# EAGLE design MIDIpod (EAGLE 9.6.2)
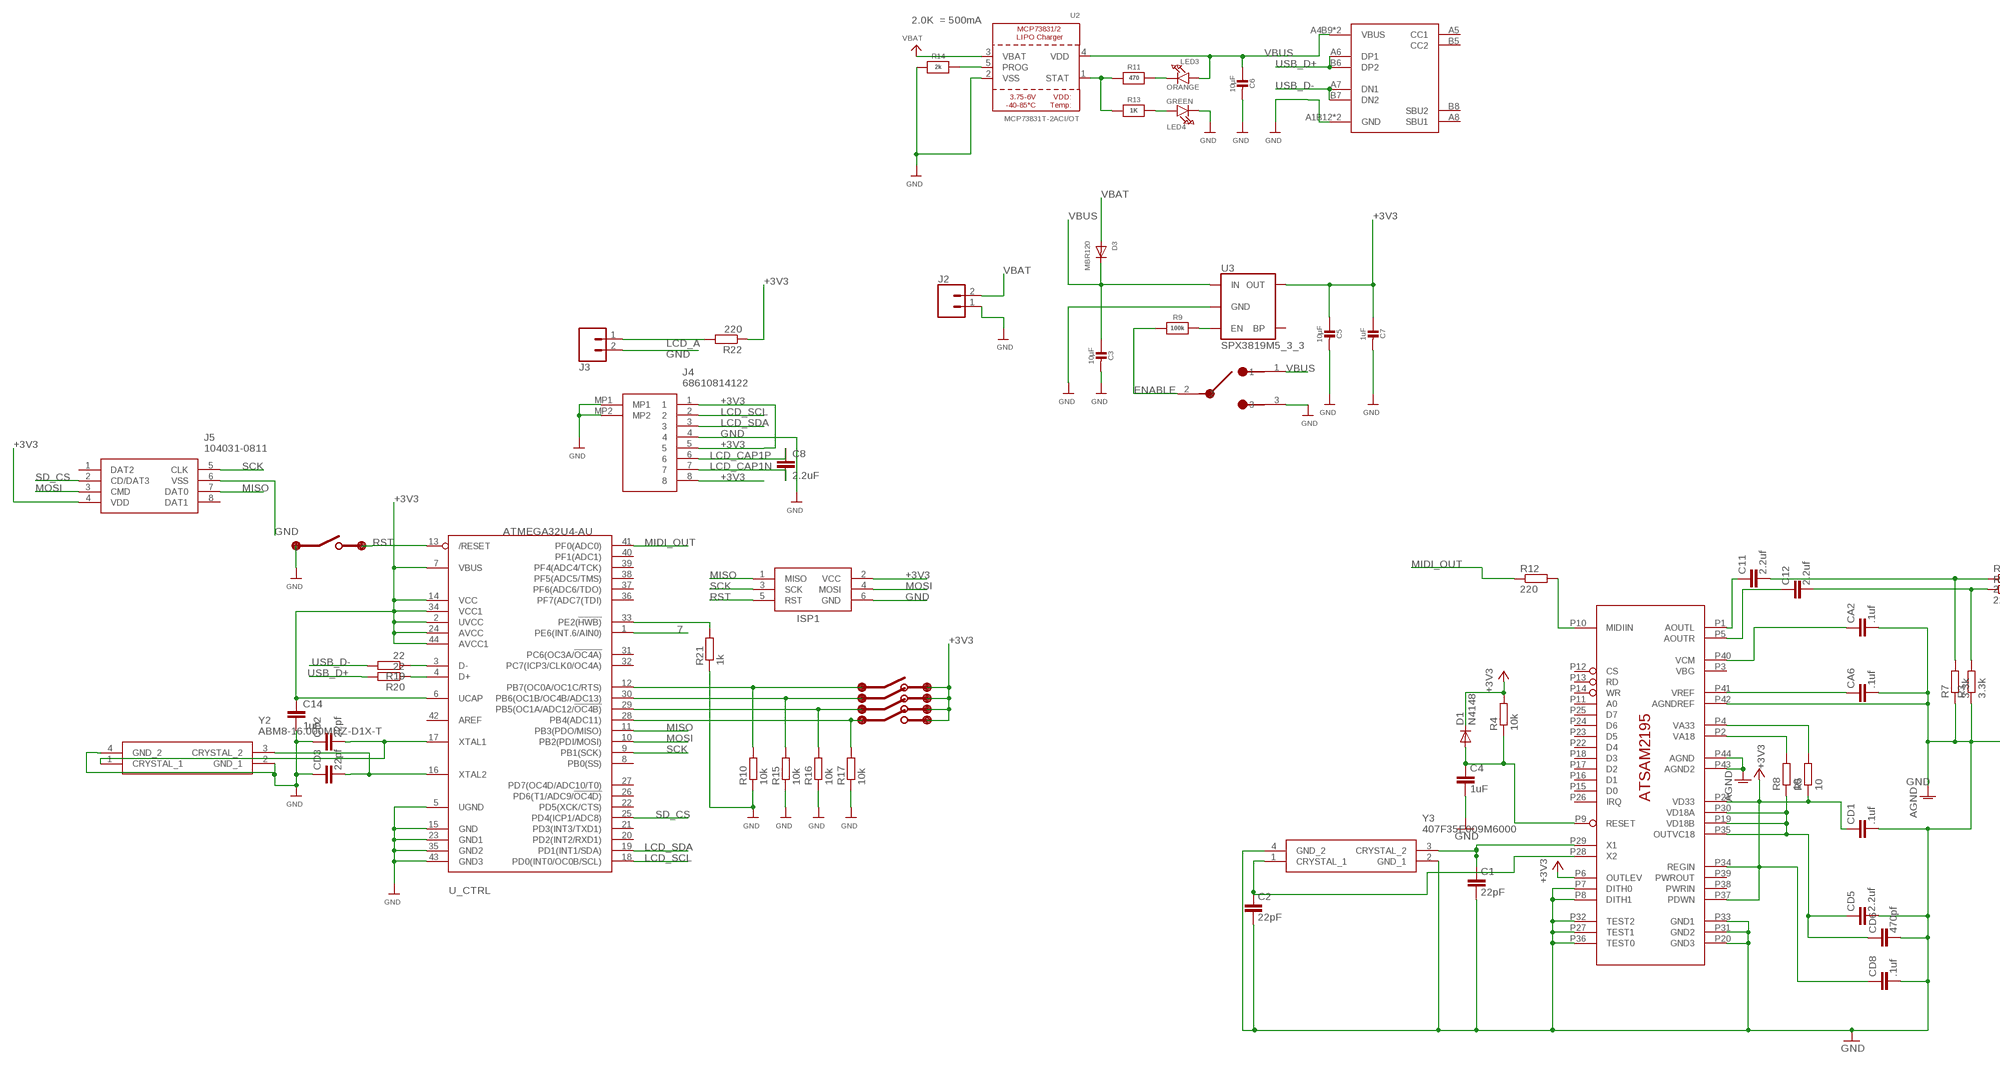
[diagram p0: schematic, sheet 1, part 1 of 2]
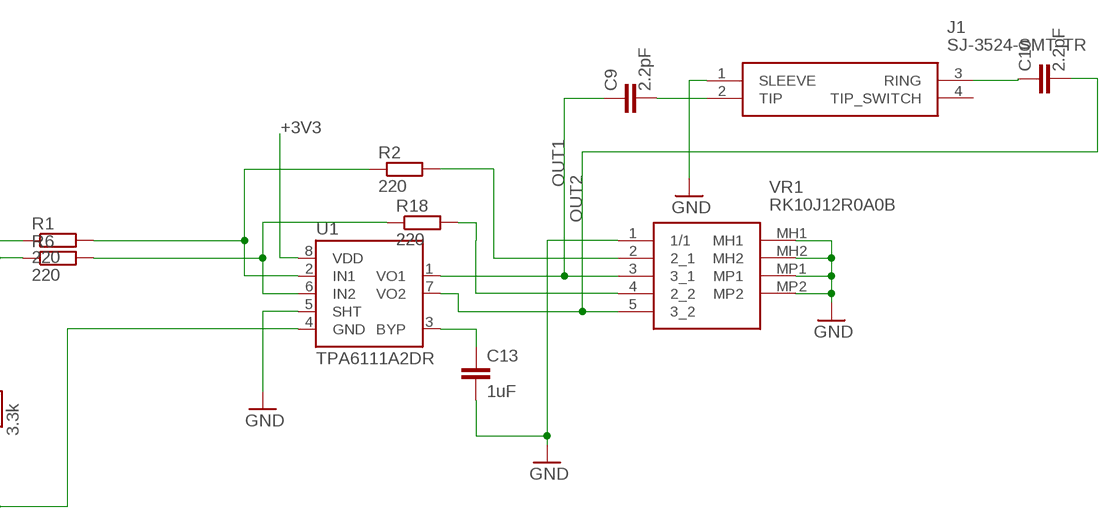
[diagram p1: schematic, sheet 1, part 2 of 2]

## Parts
BUTTON1  1U_PAD  [SILICONE_SWITCH]
BUTTON2  1U_PAD  [SILICONE_SWITCH]
BUTTON3  1U_PAD  [SILICONE_SWITCH]
BUTTON4  1U_PAD  [SILICONE_SWITCH]
BUTTON5  1U_PAD  [SILICONE_SWITCH]
C1  22pF  C-EUC0603  [C0603]
C2  22pF  C-EUC0603  [C0603]
C3  10µF  CAP_CERAMIC0805-NOOUTLINE  [0805-NO]
C4  1uF  C-EUC0603  [C0603]
C5  10µF  CAP_CERAMIC0805-NOOUTLINE  [0805-NO]
C6  10µF  CAP_CERAMIC0805-NOOUTLINE  [0805-NO]
C7  1uF  CAP_CERAMIC0805-NOOUTLINE  [0805-NO]
C8  2.2uF  2.2UF-0805-25V-(+80/-20%)  [0805]
C9  2.2pF  C-EUC0603  [C0603]
C10  2.2pF  C-EUC0603  [C0603]
C11  2.2uf  C-EUC0603  [C0603]
C12  2.2uf  C-EUC0603  [C0603]
C13  1uF  0.1UF-0402-16V-10%  [0402]
C14  1uF  0.1UF-0402-16V-10%  [0402]
CA2  .1uf  C-EUC0603  [C0603]
CA6  .1uf  C-EUC0603  [C0603]
CD1  .1uf  C-EUC0603  [C0603]
CD2  22pf  C-EUC0603  [C0603]
CD3  22pf  C-EUC0603  [C0603]
CD5  2.2uf  C-EUC0603  [C0603]
CD6  470pf  C-EUC0603  [C0603]
CD8  .1uf  C-EUC0603  [C0603]
D1  N4148  DIODESOD-123  [SOD-123]
D3  MBR120  DIODESOD-123  [SOD-123]
ISP1  AVRISP-6  [AVRISP]
J1  SJ-3524-SMT-TR  [SJ-3524-SMT-TR]
J2  CONN_02  [1X02]
J3  CONN_02  [1X02]
J4  68610814122  [68610814122]
J5  104031-0811  [1040310811]
LED3  ORANGE  LED0805_NOOUTLINE  [CHIPLED_0805_NOOUTLINE]
LED4  GREEN  LED0805_NOOUTLINE  [CHIPLED_0805_NOOUTLINE]
POWER_SW  ALPSSLIDESW  [SWITCH-SSSS810701]
R1  220  R-EU_R0603  [R0603]
R2  220  R-EU_R0603  [R0603]
R3  3.3k  R-EU_R0603  [R0603]
R4  10k  R-EU_R0603  [R0603]
R5  10  R-EU_R0603  [R0603]
R6  220  R-EU_R0603  [R0603]
R7  3.3k  R-EU_R0603  [R0603]
R8  10  R-EU_R0603  [R0603]
R9  100k  RESISTOR0805_NOOUTLINE  [0805-NO]
R10  10k  R-EU_R0603  [R0603]
R11  470  RESISTOR0805_NOOUTLINE  [0805-NO]
R12  220  R-EU_R0603  [R0603]
R13  1K  RESISTOR0805_NOOUTLINE  [0805-NO]
R14  2k  RESISTOR0805_NOOUTLINE  [0805-NO]
R15  10k  R-EU_R0603  [R0603]
R16  10k  R-EU_R0603  [R0603]
R17  10k  R-EU_R0603  [R0603]
R18  220  R-EU_R0603  [R0603]
R19  22  R-EU_R0603  [R0603]
R20  22  R-EU_R0603  [R0603]
R21  1k  R-EU_R0603  [R0603]
R22  220  R-EU_R0603  [R0603]
U1  TPA6111A2DR  TPA6111SMD-T  [SO08]
U2  MCP73831T-2ACI/OT  MCP73831/2  [SOT23-5]
U3  SPX3819M5_3_3  V_REG_SPX3819-SOT23-5  [SOT23-5]
U$1  ATSAM2195  [ATSAM2195]
U$43  TYPE-C-31-M-12  [TYPE-C-31-M-12]
U_CTRL  ATMEGA32U4-AU  [TQFP44]
VR1  RK10J12R0A0B  [RK10J12R0A0B]
Y2  ABM8-16.000MHZ-D1X-T  [ABM816000MHZD1XT]
Y3  407F35E009M6000  [407F35E009M6000]

## Nets
7: U_CTRL.1(PE6(INT.6/AIN0))
+3V3: BUTTON1.P$1 BUTTON2.P$1 BUTTON3.P$1 BUTTON4.P$1 C5.1 C7.1 C14.1 CD1.1 CD8.1 D1.C ISP1.2(VCC) J4.1 J4.5 J4.8 J5.4(VDD) R4.2 R5.1 R22.1 U1.8(VDD) U3.5(OUT) U$1.P6(OUTLEV) U$1.P21(VD33) U$1.P34(REGIN) U$1.P37(PDWN) U_CTRL.2(UVCC) U_CTRL.6(UCAP) U_CTRL.7(VBUS) U_CTRL.14(VCC) U_CTRL.24(AVCC) U_CTRL.34(VCC1) U_CTRL.44(AVCC1)
CA11: C12.1 U$1.P5(AOUTR)
ENABLE: POWER_SW.2 R9.2
GND: BUTTON5.P$2 C1.2 C2.2 C3.2 C4.2 C5.2 C6.2 C7.2 C13.2 C14.2 CA2.2 CA6.2 CD1.2 CD2.1 CD3.1 CD5.2 CD6.2 CD8.2 ISP1.6(GND) J1.1(SLEEVE) J2.1 J3.2 J4.4 J4.MP1 J4.MP2 J5.6(VSS) LED4.C POWER_SW.3 R3.1 R7.1 R10.1 R14.2 R15.1 R16.1 R17.1 R21.1 U1.4(GND) U1.5(SHT) U2.2(VSS) U3.2(GND) U$1.P7(DITH0) U$1.P8(DITH1) U$1.P20(GND3) U$1.P27(TEST1) U$1.P31(GND2) U$1.P32(TEST2) U$1.P33(GND1) U$1.P36(TEST0) U$1.P42(AGNDREF) U$1.P43(AGND2) U$1.P44(AGND) U$43.A1B12(GND) U$43.B1A12(GND) U_CTRL.5(UGND) U_CTRL.15(GND) U_CTRL.23(GND1) U_CTRL.35(GND2) U_CTRL.43(GND3) VR1.1(1/1) VR1.MH1 VR1.MH2 VR1.MP1 VR1.MP2 Y2.2(GND_1) Y2.4(GND_2) Y3.2(GND_1) Y3.4(GND_2) ; supply symbol labelled AGND
LCD_A: J3.1 R22.2
LCD_CAP1N: C8.2 J4.7
LCD_CAP1P: C8.1 J4.6
LCD_SCL: J4.2 U_CTRL.18(PD0(INT0/OC0B/SCL))
LCD_SDA: J4.3 U_CTRL.19(PD1(INT1/SDA))
MIDI_OUT: R12.1 U_CTRL.41(PF0(ADC0))
MISO: ISP1.1(MISO) J5.7(DAT0) U_CTRL.11(PB3(PDO/MISO))
MOSI: ISP1.4(MOSI) J5.3(CMD) U_CTRL.10(PB2(PDI/MOSI))
N$1: C9.2 J1.2(TIP)
N$2: R12.2 U$1.P10(MIDIIN)
N$3: C2.1 U$1.P28(X2) Y3.1(CRYSTAL_1)
N$4: C4.1 D1.A R4.1 U$1.P9(RESET)
N$5: C1.1 U$1.P29(X1) Y3.3(CRYSTAL_2)
N$6: CD5.1 CD6.1 R8.1 U$1.P19(VD18B) U$1.P30(VD18A) U$1.P35(OUTVC18)
N$7: R8.2 U$1.P2(VA18)
N$8: C11.1 U$1.P1(AOUTL)
N$9: LED3.C R11.1
N$10: C11.2 R1.1 R7.2
N$11: C12.2 R3.2 R6.1
N$12: CA2.1 U$1.P40(VCM)
N$13: R5.2 U$1.P4(VA33)
N$14: R1.2 R2.1 U1.2(IN1)
N$15: R11.2 R13.2 U2.1(STAT)
N$16: R6.2 R18.1 U1.6(IN2)
N$17: R14.1 U2.5(PROG)
N$18: LED4.A R13.1
N$19: R9.1 U3.3(EN)
N$20: CA6.1 U$1.P41(VREF)
N$21: BUTTON1.P$2 R10.2 U_CTRL.12(PB7(OC0A/OC1C/RTS))
N$22: BUTTON2.P$2 R15.2 U_CTRL.30(PB6(OC1B/OC4B/ADC13))
N$23: BUTTON3.P$2 R16.2 U_CTRL.29(PB5(OC1A/ADC12/!OC4B))
N$24: BUTTON4.P$2 R17.2 U_CTRL.28(PB4(ADC11))
N$25: C10.1 J1.3(RING)
N$26: R2.2 VR1.2(2_1)
N$27: C13.1 U1.3(BYP)
N$28: R19.1 U_CTRL.3(D-)
N$29: R18.2 VR1.4(2_2)
N$32: R20.1 U_CTRL.4(D+)
N$33: R21.2 U_CTRL.33(PE2(!HWB))
N$35: CD2.2 U_CTRL.17(XTAL1) Y2.1(CRYSTAL_1)
N$36: CD3.2 U_CTRL.16(XTAL2) Y2.3(CRYSTAL_2)
OUT1: C9.1 U1.1(VO1) VR1.3(3_1)
OUT2: C10.2 U1.7(VO2) VR1.5(3_2)
RST: BUTTON5.P$1 ISP1.5(RST) U_CTRL.13(/RESET)
SCK: ISP1.3(SCK) J5.5(CLK) U_CTRL.9(PB1(SCK))
SD_CS: J5.2(CD/DAT3) U_CTRL.25(PD4(ICP1/ADC8))
USB_D+: R20.2 U$43.A6(DP1) U$43.B6(DP2)
USB_D-: R19.2 U$43.A7(DN1) U$43.B7(DN2)
VBAT: D3.A J2.2 U2.3(VBAT)
VBUS: C3.1 C6.1 D3.C LED3.A POWER_SW.1 U2.4(VDD) U3.1(IN) U$43.A4B9(VBUS) U$43.B4A9(VBUS)
Unconnected: J1.4(TIP_SWITCH) J5.1(DAT2) J5.8(DAT1) U3.4(BP) U$1.P3(VBG) U$1.P11(A0) U$1.P12(CS) U$1.P13(RD) U$1.P14(WR) U$1.P15(D0) U$1.P16(D1) U$1.P17(D2) U$1.P18(D3) U$1.P22(D4) U$1.P23(D5) U$1.P24(D6) U$1.P25(D7) U$1.P26(IRQ) U$1.P38(PWRIN) U$1.P39(PWROUT) U$43.A5(CC1) U$43.A8(SBU1) U$43.B5(CC2) U$43.B8(SBU2) U_CTRL.8(PB0(SS)) U_CTRL.20(PD2(INT2/RXD1)) U_CTRL.21(PD3(INT3/TXD1)) U_CTRL.22(PD5(XCK/CTS)) U_CTRL.26(PD6(T1/ADC9/!OC4D)) U_CTRL.27(PD7(OC4D/ADC10/T0)) U_CTRL.31(PC6(OC3A/!OC4A)) U_CTRL.32(PC7(ICP3/CLK0/OC4A)) U_CTRL.36(PF7(ADC7(TDI)) U_CTRL.37(PF6(ADC6/TDO)) U_CTRL.38(PF5(ADC5/TMS)) U_CTRL.39(PF4(ADC4/TCK)) U_CTRL.40(PF1(ADC1)) U_CTRL.42(AREF)

## Notes on the sheet
- 2.0K  = 500mA

## Library data of the parts
BUTTON1-BUTTON5 = SiliconeSwitches:1U_PAD
C1 C2 C4 C9-C12 CA2 CA6 CD1-CD3 CD5 CD6 CD8 = rcl:C-EU: CAPACITOR, European symbol; SPICEPREFIX: C
C3 C5-C7 = microbuilder:CAP_CERAMIC: Ceramic Capacitors For new designs, use the packages preceded by an '_' character since they are more reliable: The following footprints should be used on most boards: _0402 - Standard footprint for regular board layouts _0603 - Standard footprint for regular board layouts _0805 - Standard footprint for regular board layouts _1206 - Standard footprint for regular board layouts For extremely tight-pitch boards where space is at a premium, the following 'micro-pitch' footprints can be used (smaller pads, no silkscreen outline, etc.): _0402MP - Micro-pitch footprint for very dense/compact boards _0603MP - Micro-pitch footprint for very dense/compact boards _0805MP - Micro-pitch footprint for very dense/compact boards _1206MP - Micro-pitch footprint for very dense/compact boards
C8 = SparkFun-Capacitors:2.2UF: 2.2µF ceramic capacitors A capacitor is a passive two-terminal electrical component used to store electrical energy temporarily in an electric field.; PROD_ID: CAP-11624
C13 C14 = SparkFun-Capacitors:0.1UF: 0.1µF ceramic capacitors A capacitor is a passive two-terminal electrical component used to store electrical energy temporarily in an electric field.; PROD_ID: CAP-12416; VALUE: 0.1uF
D1 D3 = adafruit:DIODE: Diode SMADIODE - SMA Surface Mount Package 20V 1A Schottky Diode Digikey: 641-1014-6-ND DO-1N4148 - Through Hole Small Current Diode SOD-123 20V 1 A (.5mV Vf) Schottky Diode - Digikey: MBRX120TPMSCT-ND SOD-323 10V 570mA (.38mV Vf, 3ns) Schottky Diode - Digikey: ZLLS410CT-ND SOD-523 30V 30mA Schottky Diode (RB751S-40TE61) - Digikey: RB751S-40TE61CT-ND SOT23-R/W - SOT23 Package (R = Solder Paste/Reflow Ovens, W = Hand-Soldering) BAT54Film 40V 300mA - Digikey: 497-7162-1-ND
ISP1 = adafruit:AVRISP: AVR ISP HEADER Standard 6 pin header for AVR programming
J1 = SamacSys_Parts:SJ-3524-SMT-TR: Phone Connectors Audio Jacks Source: Datasheet <http://www.cui.com/product/resource/sj-352x-smt-series.pdf>; DESCRIPTION: Phone Connectors Audio Jacks; HEIGHT: mm; MANUFACTURER_NAME: CUI Inc.; MANUFACTURER_PART_NUMBER: SJ-3524-SMT-TR; MOUSER_PART_NUMBER: 490-SJ-3524-SMT-TR; MOUSER_PRICE-STOCK: https://www.mouser.co.uk/ProductDetail/CUI-Devices/SJ-3524-SMT-TR?qs=WyjlAZoYn50%252B7OcNbxvx%252BA%3D%3D
J2 J3 = SparkFun-Connectors:CONN_02: Multi connection point. Often used as Generic Header-pin footprint for 0.1 inch spaced/style header connections On any of the 0.1 inch spaced packages, you can populate with these: Break Away Headers - Straight <https://www.sparkfun.com/products/116> (PRT-00116) Break Away Male Headers - Right Angle <https://www.sparkfun.com/products/553> (PRT-00553) Female Headers <https://www.sparkfun.com/products/115> (PRT-00115) Break Away Headers - Machine Pin <https://www.sparkfun.com/products/117> (PRT-00117) Break Away Female Headers - Swiss Machine Pin <https://www.sparkfun.com/products/743> (PRT-00743) For SCREWTERMINALS and SPRING TERMINALS visit here: Screw Terimnals on SparkFun.com <https://www.sparkfun.com/search/results?term=Screw+Terminals> (5mm/3.5mm/2.54mm spacing) This device is also useful as a general connection point to wire up your design to another part of your project. Our various solder wires solder well into these plated through hole pads. Hook-Up Wire - Assortment (Stranded, 22 AWG) <https://www.sparkfun.com/products/11375> (PRT-11375) Hook-Up Wire - Assortment (Solid Core, 22 AWG) <https://www.sparkfun.com/products/11367> (PRT-11367) View the entire wire category on our website here <https://www.sparkfun.com/categories/141> Special notes: Molex polarized connector foot print use with: PRT-08233 with associated crimp pins and housings. 2.54_SCREWTERM for use with PRT-10571. 3.5mm Screw Terminal footprints for PRT-08084 5mm Screw Terminal footprints for use with PRT-08432
J4 = SamacSys_Parts:68610814122: WURTH ELEKTRONIK - 68610814122 - FFC, 1MM, R/A, TOP, ZIIF, 8WAY Source: Datasheet <https://componentsearchengine.com/Datasheets/2/68610814122.pdf>; DESCRIPTION: WURTH ELEKTRONIK - 68610814122 - FFC, 1MM, R/A, TOP, ZIIF, 8WAY; HEIGHT: 4.11mm; MANUFACTURER_NAME: Wurth Elektronik; MANUFACTURER_PART_NUMBER: 68610814122; MOUSER_PART_NUMBER: 710-68610814122; MOUSER_PRICE-STOCK: https://www.mouser.co.uk/ProductDetail/Wurth-Elektronik/68610814122?qs=ZtY9WdtwX56NYUVsnEP%2Ftw%3D%3D
J5 = SamacSys_Parts:104031-0811: microSD 1.10mm SMT push-pull memory card microSD 1.10mm SMT push-pull memory card Source: Datasheet <http://www.molex.com/webdocs/datasheets/pdf/en-us/1040310811_MEMORY_CARD_SOCKET.pdf>; DESCRIPTION: microSD 1.10mm SMT push-pull memory card microSD 1.10mm SMT push-pull memory card; HEIGHT: mm; MANUFACTURER_NAME: Molex; MANUFACTURER_PART_NUMBER: 104031-0811; MOUSER_PART_NUMBER: 538-104031-0811; MOUSER_PRICE-STOCK: https://www.mouser.co.uk/ProductDetail/Molex/104031-0811?qs=udsGRKD4nA3Tvy7wqky%252BuA%3D%3D
LED3 LED4 = microbuilder:LED: LED 0603 - 0603 Surface Mount Package 2mA: Green LED - Low Power (3.9mcd, 2ma, 1.7Vf) - Digikey: 475-2709-2-ND Orange LED - Low Power (9.8mcd, 2ma, 1.8Vf) - Digikey: 475-1194-2-ND Red LED - Low Power (5mcd, 2ma, 1.8Vf) - Digikey: 475-1195-2-ND Yellow LED - Low Power (7mcd, 2ma, 1.8Vf) - Digikey: 475-1196-2-ND 5mA: Blue LED - Low Power (17mcd, 5ma, 2.9Vf) - Digikey: LNJ937W8CRACT-ND 0805 - 0805 Surface Mount Package 2mA: Red LED (8.8mcd, 2mA, 1.8Vf, Clear) - Low Power [Digikey: 475-2510-1-ND] Green LED (5mcd, 2mA, 1.8Vf, Clear) - Low Power [Digikey: 475-2730-1-ND] Yellow LED (11.3mcd, 2mA, 1.8Vf, Clear) - Low Power [Digikey: 475-2555-1-ND] 20mA: Red LED (104mcd, 20mA, Diffused) - LS R976 [Digikey: 475-1278-6-ND] Red LED (12mcd, 20mA, 2.0Vf, Clear) - APT2012EC [Digikey: 754-1128-1-ND] Green LED (15mcd, 20mA, 2.2Vf, Clear) - APT2012GC [Digikey: 754-1131-1-ND] Orange LED (160mcd, 20mA, 2.1Vf, Clear) - APT2012SECK [Digikey: 754-1130-1-ND] 1206 - 1206 Surface Mount Package Green LED (26mcd, 20mA, Diffused) - LG N971 [Digikey: 475-1407-6-ND] Red LED (15mcd, 20mA, Diffused) - LH N974 [Digikey: 475-1416-6-ND] Cree - Cree High-Power Surface Mount LEDs XPEBWT-L1-0000-00D50 - White 111lm 350mA 2.9Vf 6200K 110° XTEAWT-00-0000-00000LEE3 - White 114lm 350mA 2.85Vf 5000K 115° Everlight - Everlight 45-21 Series Surface Mount LEDs 45-21/QK2C-B2832AC2CB2/2T - Warm White 2000mcd 20mA 3.25Vf 3050K 120° 45-21/LK2C-B38452C4CB2/2T - Nuetral White 2000mcd 20mA 3.25Vf 4150K 120° 45-21/LK2C-B50634C6CB2/2T - Cold White 2200mcd 20mA 3.25Vf 5650K 120° PLCC2 Reverse Mount LS T77K-J1L2-1-0-2-R18-Z - Red 11.25mcd 2mA 1.8Vf 630nm 120° LO T77K-L1M2-24-Z - Orange 19.6mcd 2mA 1.8Vf 606nm 120° LY T77K-K2M1-26-Z - Yellow 15.7mcd 2mA 1.8Vf 587nm 120°
POWER_SW = TindieBadge:ALPSSLIDESW
R1-R8 R10 R12 R15-R22 = rcl:R-EU_: RESISTOR, European symbol; SPICEPREFIX: R
R9 R11 R13 R14 = microbuilder:RESISTOR: Resistors For new designs, use the packages preceded by an '_' character since they are more reliable: The following footprints should be used on most boards: _0402 - Standard footprint for regular board layouts _0603 - Standard footprint for regular board layouts _0805 - Standard footprint for regular board layouts _1206 - Standard footprint for regular board layouts For extremely tight-pitch boards where space is at a premium, the following 'micro-pitch' footprints can be used (smaller pads, no silkscreen outline, etc.): _0402MP - Micro-pitch footprint for very dense/compact boards _0603MP - Micro-pitch footprint for very dense/compact boards _0805MP - Micro-pitch footprint for very dense/compact boards _1206MP - Micro-pitch footprint for very dense/compact boards
U1 = SparkFun-IC-Amplifiers:TPA6111: TPA6111A2 Basic 150mW stereo headphone amplifier. SparkFun Products SparkFun FM Tuner Evaluation Board - Si4703 <https://www.sparkfun.com/products/12938> (WRL-12938); PROD_ID: IC-10149
U2 = microbuilder:MCP73831/2: MCP73831/2 LIPO Charger VDD: 3.75 - 6V Temp -40 - 85°C Programmable Charge Rate: 15-500mA NOTE: STAT is a tri-state logic output on the MCP73831 and an open-drain output on the MCP73832. SOT23-5 with 4.2V output and tri-state logic on STAT = MCP73831T-2ACI/OT
U3 = SparkFun-IC-Power:V_REG_SPX3819: SPX3819 Voltage Regulator 3.3V 500mA, 16V input Datasheet <https://www.exar.com/content/document.ashx?id=22106> SparkFun Products: SparkFun Serial Controlled Motor Driver <https://www.sparkfun.com/products/13911>; PROD_ID: VREG-13321
U$1 = ATSAM2195:ATSAM2195
U$43 = USBC:TYPE-C-31-M-12
U_CTRL = adafruit:ATMEGA32U4: http://www.ladyada.net/library/eagle
VR1 = SamacSys_Parts:RK10J12R0A0B: Potentiometers Dual Unit 10mm,15A Surface mnt Source: Datasheet <https://www.alps.com/prod/info/E/HTML/Potentiometer/RotaryPotentiometers/RKJ1/RK10J12R0A0B.html>; DESCRIPTION: Potentiometers Dual Unit 10mm,15A Surface mnt; HEIGHT: 2.5mm; MANUFACTURER_NAME: ALPS; MANUFACTURER_PART_NUMBER: RK10J12R0A0B; MOUSER_PART_NUMBER: 688-RK10J12R0A0B; MOUSER_PRICE-STOCK: https://www.mouser.co.uk/ProductDetail/ALPS/RK10J12R0A0B?qs=nR5Mw3RKkX4o8TMzstLlKA%3D%3D
Y2 = SamacSys_Parts:ABM8-16.000MHZ-D1X-T: Crystals CRYSTAL 16.0000MHZ 18PF SMD Source: Datasheet <http://www.abracon.com/Resonators/abm8.pdf>; DESCRIPTION: Crystals CRYSTAL 16.0000MHZ 18PF SMD; HEIGHT: 0.8mm; MANUFACTURER_NAME: ABRACON; MANUFACTURER_PART_NUMBER: ABM8-16.000MHz-D1X-T; MOUSER_PART_NUMBER: 815-ABM816000MHZD1XT; MOUSER_PRICE-STOCK: https://www.mouser.co.uk/ProductDetail/ABRACON/ABM8-16000MHz-D1X-T?qs=vLWxofP3U2w30ayrUAlCvg%3D%3D
Y3 = SamacSys_Parts:407F35E009M6000: CRYSTAL 9.6000MHZ 20PF SMD Source: Datasheet <http://www.ctscorp.com/wp-content/uploads/407.pdf>; DESCRIPTION: CRYSTAL 9.6000MHZ 20PF SMD; HEIGHT: 1.3mm; MANUFACTURER_NAME: CTS; MANUFACTURER_PART_NUMBER: 407F35E009M6000; MOUSER_PART_NUMBER: 774-407F35E009M6000; MOUSER_PRICE-STOCK: https://www.mouser.com/Search/Refine.aspx?Keyword=774-407F35E009M6000

## Board
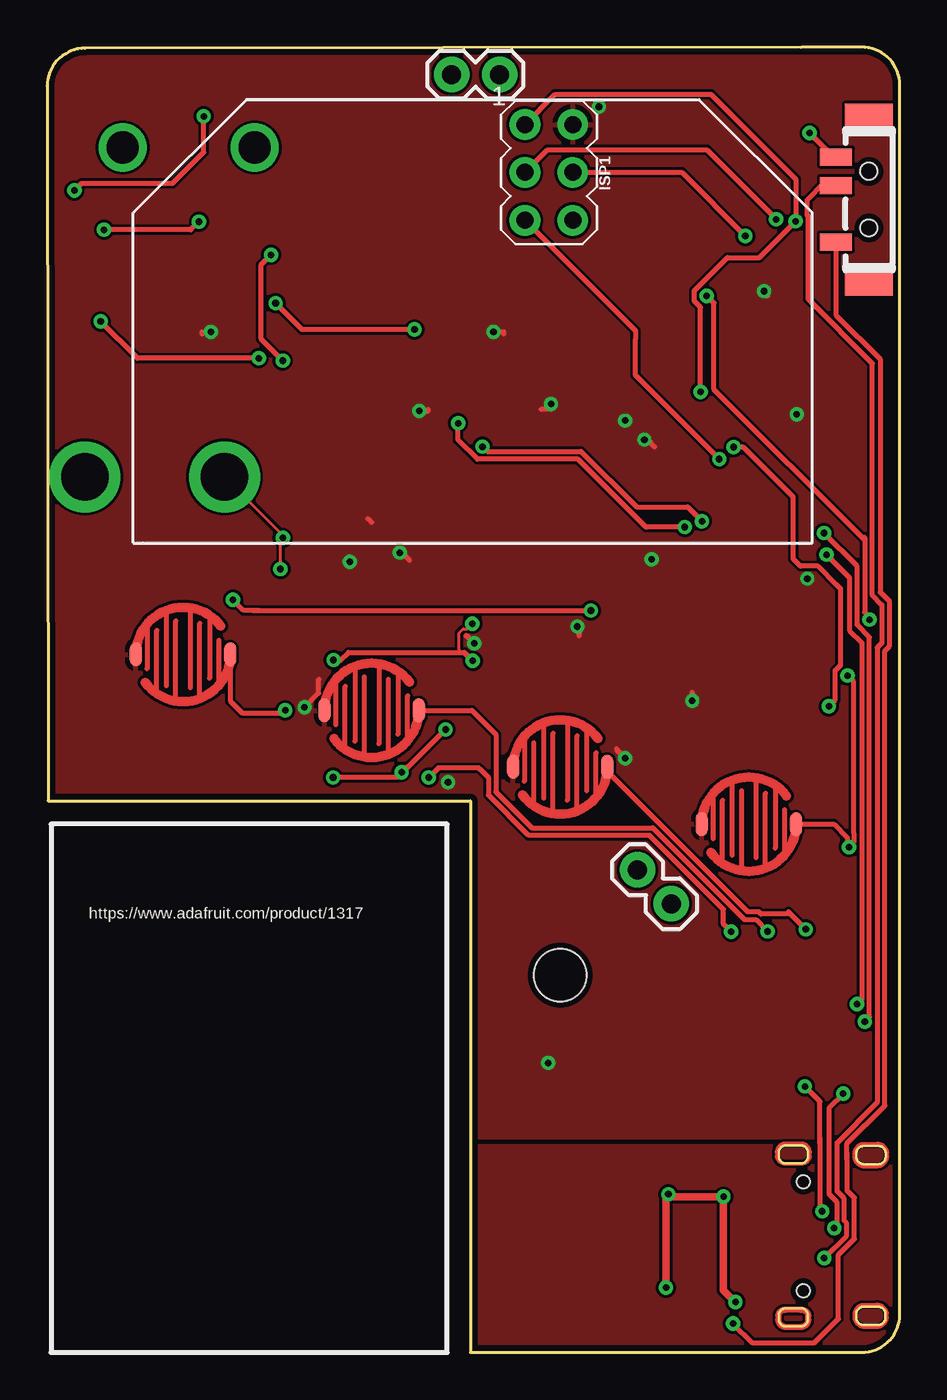
[diagram p2: board, top side]
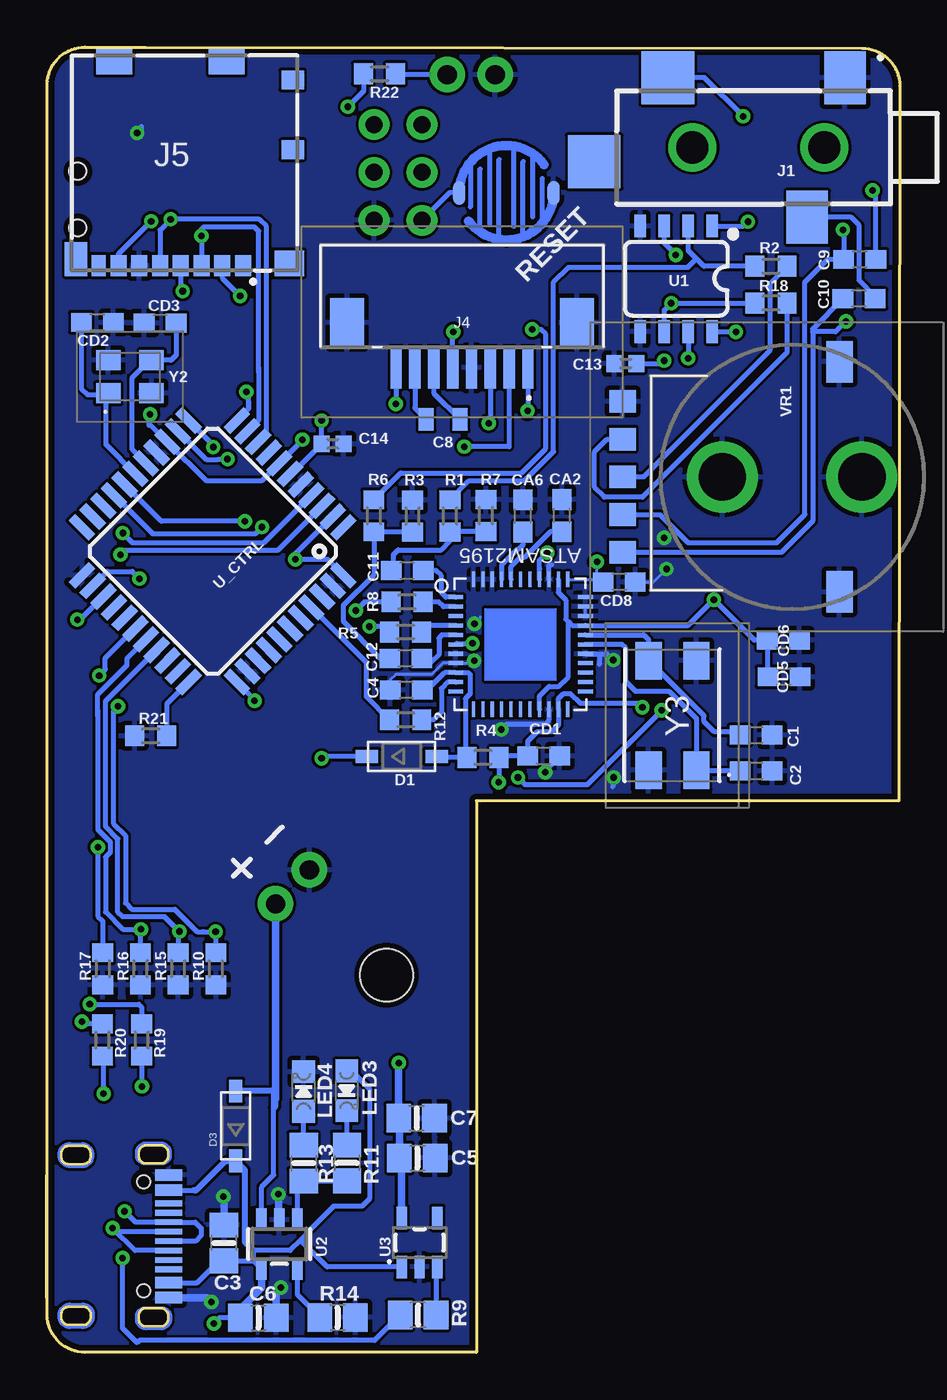
[diagram p3: board, bottom side, seen from below]

Size 45.21 x 69.2 mm. Coordinates in mm from the lower left corner, seen from the top.
Outline: 0.05,29.24 22.44,29.24 22.44,0 43.21,0 arc90 45.21,2 45.21,67.2 arc90 43.2,69.2 39.98,69.18 2,69.13 arc90 0,67.13 0.05,29.24
Copper layers (1*16): Top 0.035mm / dielectric 1.5mm / Bottom 0.035mm
Design rules "default *": minimum track width 6mil, minimum drill 0.35mm, track to track 6mil, track to pad 6mil, pad to pad 6mil, via to via 6mil, smd to smd 6mil, copper to edge 12mil, drill to drill 6mil, minimum pad ring 10mil, minimum via ring 8mil, stop-mask expansion 4mil, vias tented up to drill 0mil, thermal gap 10mil
Holes 2.8 mm at 27.21,20

### Footprints (pad centres in the part's own frame; a part is rotated, then mirrored left to right if it is on the bottom)
SILICONE_SWITCH = smd 0.635 x 1.27: P$1 -2.5,0; P$2 2.5,0
C0603 = smd 1.1 x 1: 1 -0.85,0; 2 0.85,0
0805-NO = smd 1.3 x 1.5: 1 -0.95,0; 2 0.95,0
0805 = smd 0.8 x 1.2: 1 -0.9,0; 2 0.9,0
0402 = smd 0.85 x 0.9: 1 -0.58,0; 2 0.58,0
SOD-123 = smd 1.2 x 0.7: A 1.85,0; C -1.85,0
AVRISP = drill 0.9 pad 1.626: 1 -1.27,2.54; 2 1.27,2.54; 3 -1.27,0; 4 1.27,0; 5 -1.27,-2.54; 6 1.27,-2.54
SJ-3524-SMT-TR = smd 2.2 x 2.8: 1 2.4,-6.7; 3 4.4,0.7 | smd 2.8 x 2.8: 2 11.8,-6.7; 4 15.7,-2.25 | drill 1.7 pad 2.55: 5 3.5,-3; 6 10.5,-3
1X02 = drill 1.016 pad 1.88: 1 0,0; 2 2.54,0
68610814122 = smd 0.6 x 2.2: 1 -3.5,3.8; 2 -2.5,3.8; 3 -1.5,3.8; 4 -0.5,3.8; 5 0.5,3.8; 6 1.5,3.8; 7 2.5,3.8; 8 3.5,3.8 | smd 1.8 x 2.6: MP1 -6.1,1.4; MP2 6.1,1.4
1040310811 = smd 0.85 x 1.1: 1 3.105,0.25; 2 2.005,0.25; 3 0.905,0.25; 4 -0.195,0.25; 5 -1.295,0.25; 6 -2.395,0.25; 7 -3.495,0.25 | smd 0.75 x 1.1: 8 -4.545,0.25 | smd 1.17 x 1.8: 9 -5.755,0.6 | smd 1.9 x 1.35: 10 -3.73,11.075; 11 2.24,11.075 | smd 1.2 x 1: 12 5.74,10.1; 13 5.74,6.4 | smd 1.55 x 1.35: 14 5.565,0.375
CHIPLED_0805_NOOUTLINE = smd 1.2 x 1.2: A 0,-1.05; C 0,1.05
SWITCH-SSSS810701 = smd 0.9 x 1.7: 1 -2.25,1.75; 2 0.75,1.75; 3 2.25,1.75 | smd 1.27 x 2.54: P$1 -4.445,0; P$2 4.445,0 | hole 0.9: -1.5,0; 1.5,0
R0603 = smd 1 x 1.1: 1 -0.85,0; 2 0.85,0
SO08 = smd 0.6 x 1.2: 1 -1.905,-2.8; 2 -0.635,-2.8; 3 0.635,-2.8; 4 1.905,-2.8; 5 1.905,2.8; 6 0.635,2.8; 7 -0.635,2.8; 8 -1.905,2.8
SOT23-5 = smd 0.55 x 1.2: 1 -0.95,-1.3; 2 0,-1.3; 3 0.95,-1.3; 4 0.95,1.3; 5 -0.95,1.3
ATSAM2195 = smd 0.813 x 0.203: P1 -3.441,2.5; P2 -3.441,2; P3 -3.441,1.5; P4 -3.441,1; P5 -3.441,0.5; P6 -3.441,0; P7 -3.441,-0.5; P8 -3.441,-1; P9 -3.441,-1.5; P10 -3.441,-2; P11 -3.441,-2.5; P23 3.441,-2.5; P24 3.441,-2; P25 3.441,-1.5; P26 3.441,-1; P27 3.441,-0.5; P28 3.441,0; P29 3.441,0.5; P30 3.441,1; P31 3.441,1.5; P32 3.441,2; P33 3.441,2.5 | smd 0.203 x 0.813: P12 -2.5,-3.441; P13 -2,-3.441; P14 -1.5,-3.441; P15 -1,-3.441; P16 -0.5,-3.441; P17 0,-3.441; P18 0.5,-3.441; P19 1,-3.441; P20 1.5,-3.441; P21 2,-3.441; P22 2.5,-3.441; P34 2.5,3.441; P35 2,3.441; P36 1.5,3.441; P37 1,3.441; P38 0.5,3.441; P39 0,3.441; P40 -0.5,3.441; P41 -1,3.441; P42 -1.5,3.441; P43 -2,3.441; P44 -2.5,3.441
TYPE-C-31-M-12 = smd 0.6 x 1.45: A1B12 -3.25,0.8; A4B9 -2.45,0.8; B1A12 3.25,0.8; B4A9 2.45,0.8 | smd 0.3 x 1.45: A5 -1.25,0.8; A6 -0.25,0.8; A7 0.25,0.8; A8 1.25,0.8; B5 1.75,0.8; B6 0.75,0.8; B7 -0.75,0.8; B8 -1.75,0.8 | hole 0.7: -2.89,-0.53; 2.89,-0.53
TQFP44 = smd 1.5 x 0.5: 1 -5.8,4; 2 -5.8,3.2; 3 -5.8,2.4; 4 -5.8,1.6; 5 -5.8,0.8; 6 -5.8,0; 7 -5.8,-0.8; 8 -5.8,-1.6; 9 -5.8,-2.4; 10 -5.8,-3.2; 11 -5.8,-4; 23 5.8,-4; 24 5.8,-3.2; 25 5.8,-2.4; 26 5.8,-1.6; 27 5.8,-0.8; 28 5.8,0; 29 5.8,0.8; 30 5.8,1.6; 31 5.8,2.4; 32 5.8,3.2; 33 5.8,4 | smd 0.5 x 1.5: 12 -4,-5.8; 13 -3.2,-5.8; 14 -2.4,-5.8; 15 -1.6,-5.8; 16 -0.8,-5.8; 17 0,-5.8; 18 0.8,-5.8; 19 1.6,-5.8; 20 2.4,-5.8; 21 3.2,-5.8; 22 4,-5.8; 34 4,5.8; 35 3.2,5.8; 36 2.4,5.8; 37 1.6,5.8; 38 0.8,5.8; 39 0,5.8; 40 -0.8,5.8; 41 -1.6,5.8; 42 -2.4,5.8; 43 -3.2,5.8; 44 -4,5.8
RK10J12R0A0B = smd 1.2 x 1.4: 1 -4,-9; 2 0,-9; 3 2,-9; 4 -2,-9; 5 4,-9 | drill 2.508 pad 3.762: MH1 0,-3.7; MH2 0,3.7 | smd 2.2 x 1.4: MP1 6.1,2.5; MP2 -6.1,2.5
ABM816000MHZD1XT = smd 1.3 x 1.05: 1 -1.15,-0.875; 2 1.15,-0.875; 3 1.15,0.875; 4 -1.15,0.875
407F35E009M6000 = smd 2 x 1.4: 1 -2.9,-1.27; 2 2.9,-1.27; 3 2.9,1.27; 4 -2.9,1.27

### Placement (x,y rotation side)
BUTTON1  7.21,37 0 top
BUTTON2  17.21,34.04 0 top
BUTTON3  27.21,31.04 0 top
BUTTON4  37.21,28 0 top
BUTTON5  20.86,61.48 0 bottom
C1  7.61,32.73 0 bottom
C2  7.61,30.83 0 bottom
C3  35.83,5.8 90 bottom
C4  26.16,35.11 180 bottom
C5  25.58,10.3 0 bottom
C6  34.01,1.83 0 bottom
C7  25.62,12.42 0 bottom
C8  24.21,49.47 180 bottom
C9  2.12,57.95 0 bottom
C10  2.16,55.86 180 bottom
C11  26.11,41.44 180 bottom
C12  26.19,36.79 180 bottom
C13  14.53,52.42 180 bottom
C14  30.06,48.16 0 bottom
CA2  17.91,44.35 90 bottom
CA6  19.97,44.34 90 bottom
CD1  18.88,31.62 0 bottom
CD2  42.54,54.6 180 bottom
CD3  39.21,54.57 0 bottom
CD5  6.13,35.81 0 bottom
CD6  6.16,37.76 0 bottom
CD8  14.87,40.85 0 bottom
D1  26.4,31.59 0 bottom
D3  35.21,12 90 bottom
ISP1  26.6,62.56 0 top
J1  0.5,60.88 180 bottom
J2  31.3,25.58 315 top
J3  23.99,67.74 180 top
J4  23.21,56 180 bottom
J5  37.93,57.36 0 bottom
LED3  29.32,13.87 180 bottom
LED4  31.61,13.83 0 bottom
POWER_SW  43.58,61.11 90 top
R1  23.85,44.34 90 bottom
R2  6.82,57.58 0 bottom
R3  25.83,44.34 270 bottom
R4  22.1,31.54 0 bottom
R5  26.2,38.19 0 bottom
R6  27.88,44.35 90 bottom
R7  21.94,44.35 270 bottom
R8  26.12,39.79 0 bottom
R9  25.54,1.98 180 bottom
R10  36.26,20.34 90 bottom
R11  29.3,10.04 270 bottom
R12  26.19,33.53 0 bottom
R13  31.6,10.03 270 bottom
R14  29.81,1.85 0 bottom
R15  38.26,20.34 90 bottom
R16  40.26,20.34 90 bottom
R17  42.26,20.34 90 bottom
R18  6.82,55.63 0 bottom
R19  40.19,16.55 270 bottom
R20  42.27,16.55 270 bottom
R21  39.72,32.69 0 bottom
R22  27.59,67.78 0 bottom
U1  11.85,56.91 180 bottom
U2  32.9,5.74 180 bottom
U3  25.46,5.82 0 bottom
U$1  20.11,37.53 0 bottom
U$43  39.57,6.15 270 bottom
U_CTRL  36.43,42.47 225 bottom
VR1  5.7,46.41 270 bottom
Y2  40.82,51.72 0 bottom
Y3  12.05,33.77 90 bottom

### Tracks (layer width: path | path; a pad name or v marks a point on that pad's centre or on a via)
+3V3  (via drill 0.35)
  Top 0.152: v16.05,41.91 16.14,42 16.21,42
  Top 0.254: v31.67,48.39 31.82,48.39 32.21,48 | v39.75,49.73 39.72,49.73 39.67,49.78 39.54,49.78 | v40.31,41.02 40.23,41.02 40.21,41 | v32.05,42.04 32.17,42.04 32.21,42 | v19.73,49.91 20.21,49.91 20.21,50 | v26.72,50.29 26.72,50 26.21,50 | v23.67,54.1 24.21,54.1 24.21,54 | v8.68,54.1 8.68,54 8.21,54 8.21,54.1 | v22.65,37.59 22.25,38 22.21,38 | v28.11,38.48 28.21,38.39 28.21,38 | v13.65,34.2 14.4,34.95 14.4,35.69 | v21.26,30.23 21.26,30.05 21.21,30 | v30.65,31.5 30.21,31.94 30.21,32 | v34.21,34.54 v34.21,34.55 34.21,35 | 17.01,44.2 17.21,44 | v18.7,42.4 18.81,42.4 19.21,42 | v38.02,56.26 38.02,56.19 38.21,56
  Bottom 0.152: U$1.P34 15.75,40.98 15.72,40.95 | CD8.1 16.05,41.17 v16.05,41.91
  Bottom 0.254: 15.72,40.95 CD8.1 | U_CTRL.6 32.24,46.57 C14.1 30.64,49.39 v30.65,49.4 | v31.67,48.39 31.67,48.36 U_CTRL.7 33.8,46.23 36.79,46.23 U_CTRL.14 39.71,49.15 39.8,49.15 39.8,49.68 v39.75,49.73 | U_CTRL.24 42.02,41.4 40.69,41.4 v40.31,41.02 | U_CTRL.44 30.33,42.04 v32.05,42.04 32.05,42.32 U_CTRL.2 | J4.1 19.71,49.91 v19.73,49.91 | 26.59,15.37 26.59,15.34 v26.57,15.34 | J4.8 v26.71,50.29 v26.72,50.29 | J4.5 23.71,54.1 v23.67,54.1 | U1.8 v8.68,54.1 | 19.1,41.53 U$1.P37 19.11,41.99 v18.7,42.4 | U$1.P6 23.49,37.59 v22.65,37.59 | R5.1 27.34,38.48 v28.11,38.48 | v13.65,34.2 13.87,34.42 16.94,34.42 17.45,34.92 17.83,34.92 18.08,34.67 18.08,34.12 U$1.P21 18.11,33.25 18.46,32.89 19.22,32.89 19.73,32.39 CD1.1 21.17,31.62 R4.2 v21.25,30.23 v21.26,30.23 | D1.C 30.56,31.59 v30.65,31.5 | U_CTRL.34 34.21,34.6 v34.21,34.54 | R22.1 28.44,66.86 v29.26,66.04 | J5.4 38.12,56.36 v38.02,56.26
  Bottom 0.406: U3.5 26.41,10.19 C5.1 26.53,12.38 C7.1 v26.57,15.34 26.59,15.37
  pour Top: 0.05,69.09 0.05,29.21 22.4,29.21 22.4,11.43 45.26,11.43 45.26,69.09
CA11
  Bottom 0.254: U$1.P5 24.27,38.03 24.43,37.87 24.43,36.98 24.82,36.6 25.15,36.6 C12.1
ENABLE  (via drill 0.35)
  Top 0.254: v41.21,5 42.39,6.19 42.39,6.86 42.27,6.99 42.27,7.37 42.27,8.15 41.89,8.53 41.89,11.12 43.98,13.21 44.01,13.24 44.01,37.36 44.27,37.62 44.27,39.63 43.76,40.14 43.76,52.43 40.35,55.84 40.35,60.24 40.31,60.28 40.31,61.09 41.2,61.98 41.71,61.98 POWER_SW.2
  Bottom 0.254: v41.21,5 41.21,1.28 41.07,1.14 40.43,0.51 40.31,0.64 27.83,0.64 R9.2
GND  (via drill 0.35)
  Top 0.152: v12.37,41.53 12.37,43.05 v12.49,43.18 12.49,43.32 VR1.MH1 | v22.57,36.66 22.44,36.66 21.85,37.25 21.85,38.15 22.06,38.36 22.27,38.36 v22.55,38.63
  Top 0.254: v21.13,33.02 19.16,31.05 | 19.16,31.05 18.59,30.48 v15.16,30.48 | v18.79,30.76 19.09,31.05 19.16,31.05 | POWER_SW.3 41.71,63.36 v40.43,64.64 | v15.18,36.7 15.57,36.7 15.98,37.11 22.12,37.11 v22.57,36.66
  Top 0.406: v32.81,3.43 32.81,8.26 v32.94,8.38 33.07,8.26 v35.86,8.26 35.86,3.3 v36.5,2.67
  Bottom 0.152: CD8.2 13.05,40.85 v12.37,41.53 | v12.49,43.18 12.31,43 12.21,43 | U$1.P31 U$1.P32 | v22.57,36.66 22.69,36.53 U$1.P8 24.22,36.53 24.81,35.94 26.72,35.94 27.01,35.65 C4.2 | v22.55,38.63 22.24,38.94 22.24,39
  Bottom 0.254: 25.42,4.48 U3.2 | U$1.P20 18.61,33.51 18.82,33.3 19.39,33.3 19.42,33.27 20.88,33.27 v21.13,33.02 | U$1.P36 18.59,40.99 18.59,41.74 18.46,41.74 | v15.16,30.48 15.21,30.43 15.21,30 | CD1.2 18.79,30.86 v18.79,30.76 | 15.92,36.48 15.92,36.89 16.07,37.03 U$1.P27 15.52,37.03 v15.18,36.7 | v40.43,64.64 40.21,64.87 40.21,65
  Bottom 0.406: C3.2 35.83,8.22 v35.86,8.26 | v32.94,8.38 32.94,7.08 U2.2 | C6.2 33.06,3.19 v32.81,3.43 | U$43.B1A12 36.73,2.9 v36.5,2.67
  pour Bottom: 22.53,0 22.53,17.27 45.26,17.27 45.26,2 arc-90 43.26,0
  pour Bottom: 22.4,0 22.4,29.21 0.05,29.21 0.05,69.09 45.13,69.09 45.13,0
LCD_A
  Bottom 0.254: J3.1 26.69,67.74 R22.2
LCD_CAP1N
  Bottom 0.254: J4.7 25.71,50.06 C8.2
LCD_CAP1P
  Bottom 0.254: J4.6 24.71,50.86 C8.1
LCD_SCL  (via drill 0.35)
  Top 0.254: v23.08,48.02 23.34,47.76 28.31,47.76 31.26,44.82 33.97,44.82 v34.72,44.06
  Bottom 0.254: J4.2 20.71,48.02 v23.08,48.02 | v34.72,44.06 39.15,44.06 U_CTRL.18
LCD_SDA  (via drill 0.35)
  Top 0.254: v33.81,43.75 31.75,43.75 28.15,47.36 22.81,47.36 21.8,48.37 v21.8,49.26
  Bottom 0.254: U_CTRL.19 39.62,43.41 34.16,43.41 v33.81,43.75 | J4.3 21.71,49.35 v21.8,49.26
MIDI_OUT
  Bottom 0.254: R12.1 28.27,34.76 28.27,36.56 31.19,39.48 U_CTRL.41
MISO  (via drill 0.35)
  Top 0.254: v34.65,50.93 34.65,55.4 34.31,55.73 34.31,56.01 | 34.31,56.01 34.31,56.26 | ISP1.1 26.93,66.7 35.2,66.7 39.69,62.21 v39.69,59.96 37.77,58.04 36.07,58.04 34.31,56.28 34.31,56.01
  Bottom 0.254: 34.52,50.04 34.52,50.38 34.51,50.39 | 34.52,50.04 U_CTRL.11 | 34.52,50.04 34.52,50.8 v34.65,50.93 | v39.69,59.96 41.42,58.24 J5.7
MOSI  (via drill 0.35)
  Top 0.254: ISP1.4 33.65,62.56 v37.02,59.18
  Bottom 0.254: U_CTRL.10 33.99,49.44 33.99,51.94 | 33.99,52.18 33.99,51.94 | 33.99,51.94 33.99,59.44 34.21,59.66 36.9,59.66 37.02,59.55 v37.02,59.18 J5.3
N$1  (via drill 0.35)
  Top 0.254: v1.44,61.59 1.83,61.98 6.65,61.98 8.3,63.63 v8.3,65.53
  Bottom 0.254: J1.2 10.35,67.58 v8.3,65.53 | C9.2 1.27,61.42 v1.44,61.59
N$2
  Bottom 0.254: U$1.P10 23.98,35.53 24.31,35.2 24.31,33.93 24.71,33.53 R12.2
N$3
  Bottom 0.254: U$1.P28 14.72,37.53 14.53,37.34 14.53,35.56 14.02,35.05 12.24,35.05 10.78,33.59 Y3.1 10.74,30.83 C2.1
N$4
  Bottom 0.254: C4.1 25.06,35.11 24.13,36.03 U$1.P9 22.87,36.03 22.78,35.94 22.78,34.91 23.03,34.66 23.03,31.62 R4.1 24.5,31.54 D1.A
N$5
  Bottom 0.254: U$1.P29 13.57,38.03 13.32,37.78 13.32,36.7 | 13.32,36.7 Y3.3 | C1.1 8.62,32.89 9.83,32.89 10.37,33.44 10.37,33.76 12.07,35.46 13.32,36.7
N$6  (via drill 0.35)
  Top 0.254: 10.91,39.33 11.22,39.33 | 11.22,39.33 v28.84,39.33 | 11.22,39.33 10.42,39.33 v9.85,39.9
  Bottom 0.254: U$1.P35 18.11,40.28 17.7,39.88 17.7,38.86 17.57,38.73 | 17.57,38.73 17.37,38.53 U$1.P30 11.22,38.53 v9.85,39.9 7.71,37.76 CD6.1 7.01,35.84 CD5.1 | U$1.P19 19.1,34.1 19.1,34.8 18.59,35.31 18.08,35.31 17.57,35.81 17.57,38.73 | R8.1 28.38,39.79 v28.84,39.33
N$7
  Bottom 0.254: U$1.P2 24.19,39.53 24.45,39.79 R8.2
N$8
  Bottom 0.254: U$1.P1 24.06,40.03 24.31,40.28 24.31,41.17 24.58,41.44 C11.1
N$9
  Bottom 0.254: R11.1 29.3,12.8 LED3.C
N$10
  Bottom 0.254: R7.2 23.84,43.51 R1.1 23.85,43 24.3,42.55 26.59,42.55 26.84,42.29 26.84,41.56 C11.2
N$11
  Bottom 0.254: C12.2 27.55,36.79 29.51,38.76 29.51,39.58 27.88,41.21 R6.1 27.87,43.49 R3.2
N$12
  Bottom 0.254: U$1.P40 20.61,41.67 20.11,42.16 19.86,42.16 18.52,43.51 CA2.1
N$13
  Bottom 0.254: U$1.P4 25,38.53 R5.2
N$14
  Bottom 0.254: R1.2 22.83,46.21 19.89,46.21 18.35,47.75 18.35,56.76 17.58,57.53 11.22,57.53 10.78,57.98 | R2.1 10.38,57.58 10.78,57.98 | U1.2 11.21,58.41 10.78,57.98
N$15
  Bottom 0.254: U2.1 31.95,8.73 R13.2 29.32,9.08 R11.2
N$16  (via drill 0.35)
  Top 0.254: v19.48,54.23 13.51,54.23 v12.11,55.63
  Bottom 0.254: R6.2 26.46,46.62 20.06,46.62 18.76,47.92 18.76,53.98 19.01,54.23 v19.48,54.23 | U1.6 12.48,55.25 v12.11,55.63 R18.1
N$17
  Bottom 0.254: U2.5 31.95,3.07 30.76,1.88 R14.1
N$18
  Bottom 0.254: R13.1 LED4.A
N$19
  Bottom 0.254: U3.3 24.59,4.45 R9.1
N$20
  Bottom 0.254: CA6.1 19.99,42.8 20.22,42.57 20.28,42.57 21.11,41.75 U$1.P41
N$21  (via drill 0.35)
  Top 0.254: 36.03,22.54 v36.27,22.3 35.86,22.71 35.86,23.49 31.94,27.41 25.53,27.41 23.39,29.55 23.39,30.48 23.02,30.85 | v41.45,34.25 41.79,34.59 41.79,36.15 42.07,36.42 42.07,40.5 | 42.07,40.5 41.88,40.69 | 41.88,40.69 40.88,41.69 39.94,41.69 39.55,42.07 39.55,45.35 36.91,47.99 v36.4,47.99 | 41.88,40.69 42.07,40.5 | 22.88,30.99 23.02,30.85 | 23.02,30.85 22.88,30.99 | v20.24,30.48 20.75,30.99 22.88,30.99 | BUTTON1.P$2 9.71,34.54 10.33,33.91 12.49,33.91 v12.62,34.04
  Bottom 0.254: 36.94,22.3 36.91,22.3 | 36.91,22.3 v36.27,22.3 36.26,22.28 R10.2 | v36.4,47.99 36.4,48.1 U_CTRL.12 | v41.45,34.25 41.7,34 41.7,28.05 41.05,27.39 41.05,23.82 40.72,23.49 38.44,23.49 37.25,22.3 36.91,22.3 | v20.24,30.48 19.86,30.1 16.56,30.1 v12.62,34.04
N$22  (via drill 0.35)
  Top 0.254: v38.2,22.32 37.57,22.95 36.98,22.95 32.11,27.81 25.7,27.81 23.8,29.72 23.8,32.77 22.52,34.04 BUTTON2.P$2
  Bottom 0.254: U_CTRL.30 42.11,34.52 42.11,27.88 41.45,27.22 41.45,23.32 41.21,23.08 38.97,23.08 v38.2,22.32 38.26,22.26 R15.2
N$23  (via drill 0.35)
  Top 0.254: v40.23,22.43 39.42,23.24 | 39.42,23.24 39.3,23.35 | 39.42,23.24 37.85,23.24 37.74,23.35 37.15,23.35 29.71,30.79 BUTTON3.P$2
  Bottom 0.254: 42.52,33.72 42.52,34.02 | 42.52,34.02 42.52,34.88 41.79,35.61 41.79,35.62 40.97,36.44 40.97,36.79 U_CTRL.29 | 42.52,34.02 42.52,27.71 41.86,27.05 41.86,26.51 42.11,26.26 42.11,23.35 41.19,22.43 v40.23,22.43 40.26,22.4 R16.2
N$24  (via drill 0.35)
  Top 0.254: v42.45,35.88 42.77,35.56 42.77,27.55 42.76,27.54 42.76,27.03 v42.52,26.78 42.44,26.78 42.44,27.27 41.71,28 BUTTON4.P$2
  Bottom 0.254: v42.45,35.88 42.12,36.21 42.12,36.82 40.56,38.37 U_CTRL.28 | R17.2 42.26,22.86 42.52,23.12 v42.52,26.78
N$25
  Bottom 0.254: C10.1 1.31,56 2.15,56.84 2.15,59.76 2.57,60.18 J1.3
N$26
  Bottom 0.254: R2.2 6.89,56.66 6.89,53.1 13.58,46.41 VR1.2
N$27  (via drill 0.35)
  Top 0.254: v12.49,52.58 11.35,53.72 11.35,57.67 v11.87,58.19
  Bottom 0.254: C13.1 12.65,52.42 v12.49,52.58 | v11.87,58.19 12.48,58.8 U1.3
N$28  (via drill 0.35)
  Top 0.254: v41.32,42.29 42.54,41.07 42.54,38.28 43.2,37.62 43.2,18.71 v42.95,18.46
  Bottom 0.254: U_CTRL.3 32.98,42.52 41.09,42.52 v41.32,42.29 | v42.95,18.46 40.35,18.46 40.19,18.3 R19.1
N$29
  Bottom 0.254: R18.2 5.97,53 13.64,45.34 15.67,45.34 16.18,45.85 16.18,47.75 15.52,48.41 VR1.4
N$32  (via drill 0.35)
  Top 0.254: v43.35,17.53 43.61,17.78 43.61,37.92 42.95,38.58 42.95,40.01 42.95,41.68 v41.2,43.43
  Bottom 0.254: R20.1 43.23,17.41 v43.35,17.53 | v41.2,43.43 40.69,42.93 33.71,42.93 U_CTRL.4
N$33
  Bottom 0.254: U_CTRL.33 38.87,34.38 R21.2
N$34
  pour Top: 22.4,0 22.4,10.92 45.13,10.92 45.13,2 arc-90 43.13,0
N$35
  Bottom 0.254: U_CTRL.17 42.08,48.12 42.08,50.73 42.05,50.76 | 42.05,50.76 Y2.1 | CD2.2 43.39,51.09 43.06,50.76 42.05,50.76
N$36
  Bottom 0.254: U_CTRL.16 40.69,47.86 40.69,51.69 39.78,52.6 Y2.3 38.64,52.6 38.36,52.87 CD3.2
OUT1  (via drill 0.35)
  Top 0.254: v8.05,59.94 7.62,59.52 v3.01,59.52
  Bottom 0.254: VR1.3 12.71,44.41 11.22,42.93 6.52,42.93 5.03,44.42 5.03,56.74 3.82,57.95 C9.1 2.97,59.48 v3.01,59.52 | U1.1 8.28,59.71 v8.05,59.94
OUT2  (via drill 0.35)
  Top 0.254: v11.22,52.7 4.79,52.7 v2.84,54.65
  Bottom 0.254: C10.2 4.62,54.25 4.62,54.1 | VR1.5 6.28,42.41 4.62,44.07 4.62,54.1 | U1.7 11.21,52.71 v11.22,52.7 | v2.84,54.65 3.39,54.1 4.62,54.1
RST  (via drill 0.35)
  Top 0.254: v35.64,47.36 31.19,51.8 31.19,53.72 31.19,54.15 ISP1.5
  Bottom 0.254: v35.64,47.36 36.11,47.36 36.13,47.33 36.76,47.33 U_CTRL.13 | BUTTON5.P$1 23.87,61.48 ISP1.5
SCK  (via drill 0.35)
  Top 0.254: ISP1.3 26.53,63.75 34.97,63.75 v38.66,60.07
  Bottom 0.254: U_CTRL.9 33.58,48.71 33.58,59.7 33.96,60.07 v38.66,60.07 39.22,59.51 J5.5
SD_CS  (via drill 0.35)
  Top 0.254: 43.35,43.2 43.35,43.05 | 43.35,43.05 43.35,39.23 43.61,38.98 v43.61,38.85 | 43.35,43.05 35.35,51.05 35.35,55.63 v34.97,56.01
  Bottom 0.254: v43.61,38.85 43.44,38.85 U_CTRL.25 | J5.2 35.92,56.95 v34.97,56.01
USB_D+  (via drill 0.35)
  Top 0.254: v41.74,6.59 41.86,6.71 41.86,7.99 41.48,8.37 41.48,12.99 v42.21,13.72
  Bottom 0.254: U$43.A6 41.55,6.4 v41.74,6.59 40.55,5.4 U$43.B6 | v42.21,13.72 42.21,15.64 R20.2
USB_D-  (via drill 0.35)
  Top 0.254: 40.97,11.36 40.97,11.05 | 40.97,11.05 40.97,7.6 v41.1,7.48 | 40.97,11.05 40.97,13.3 v40.18,14.1
  Bottom 0.254: U$43.A7 37.34,5.9 37.04,6.21 37.04,6.59 37.35,6.9 U$43.B7 40.52,6.9 v41.1,7.48 | v40.18,14.1 40.18,15.69 R19.2
VBAT
  Bottom 0.254: U2.3 33.83,7.05 33.83,8.76 33.19,9.4 33.19,12.95 33.19,13.84
  Bottom 0.305: 33.19,13.84 33.2,13.85 D3.A | 33.19,12.95 33.1,13.05 33.1,13.84
  Bottom 0.406: J2.2 33.1,13.84 33.1,13.44
VBUS  (via drill 0.35)
  Top 0.254: v36.37,1.52 37.39,0.51 40.69,0.51 41.96,1.78 41.96,5.18 42.8,6.02 42.8,8.2 42.42,8.58 42.42,9.02 | 42.42,9.02 42.42,9.14 | 42.42,9.02 42.42,10.19 42.41,10.2 42.41,10.34 42.4,10.43 42.4,10.44 42.4,10.47 42.41,10.47 42.41,10.56 42.41,11.07 44.42,13.07 44.42,37.19 44.67,37.45 44.67,39.8 44.17,40.3 44.17,52.66 41.83,54.99 POWER_SW.1
  Bottom 0.254: 34.96,2.18 C6.1 36.06,1.83 v36.37,1.52 | U$43.B4A9 37.24,3.7 36.09,4.85 C3.1 34.26,4.85 | U2.4 34.26,4.85 | U$43.A4B9 37.42,8.6 | 34.26,4.85 34.26,5.38 34.27,5.4 | 34.27,5.4 34.53,5.65 34.72,5.84 | LED3.A 29.07,14.92 28.11,13.97 28.11,8.13 28.5,7.75 30.02,7.75 31.39,6.38 31.39,6.32 31.77,5.94 | 31.77,5.94 32.32,5.4 34.27,5.4 | U3.1 30.35,4.52 31.77,5.94
  Bottom 0.305: 34.53,5.65 34.72,5.84 34.72,9.66 D3.C 35.73,10.16 37.29,8.6 37.42,8.6
  Bottom 0.406: U2.4 33.85,3.41 34.96,2.3 34.96,2.18

### Text on the board
tPlace: https://www.adafruit.com/product/1317
bPlace: RESET